# Altium schematic sheet Connections.SchDoc
size A4
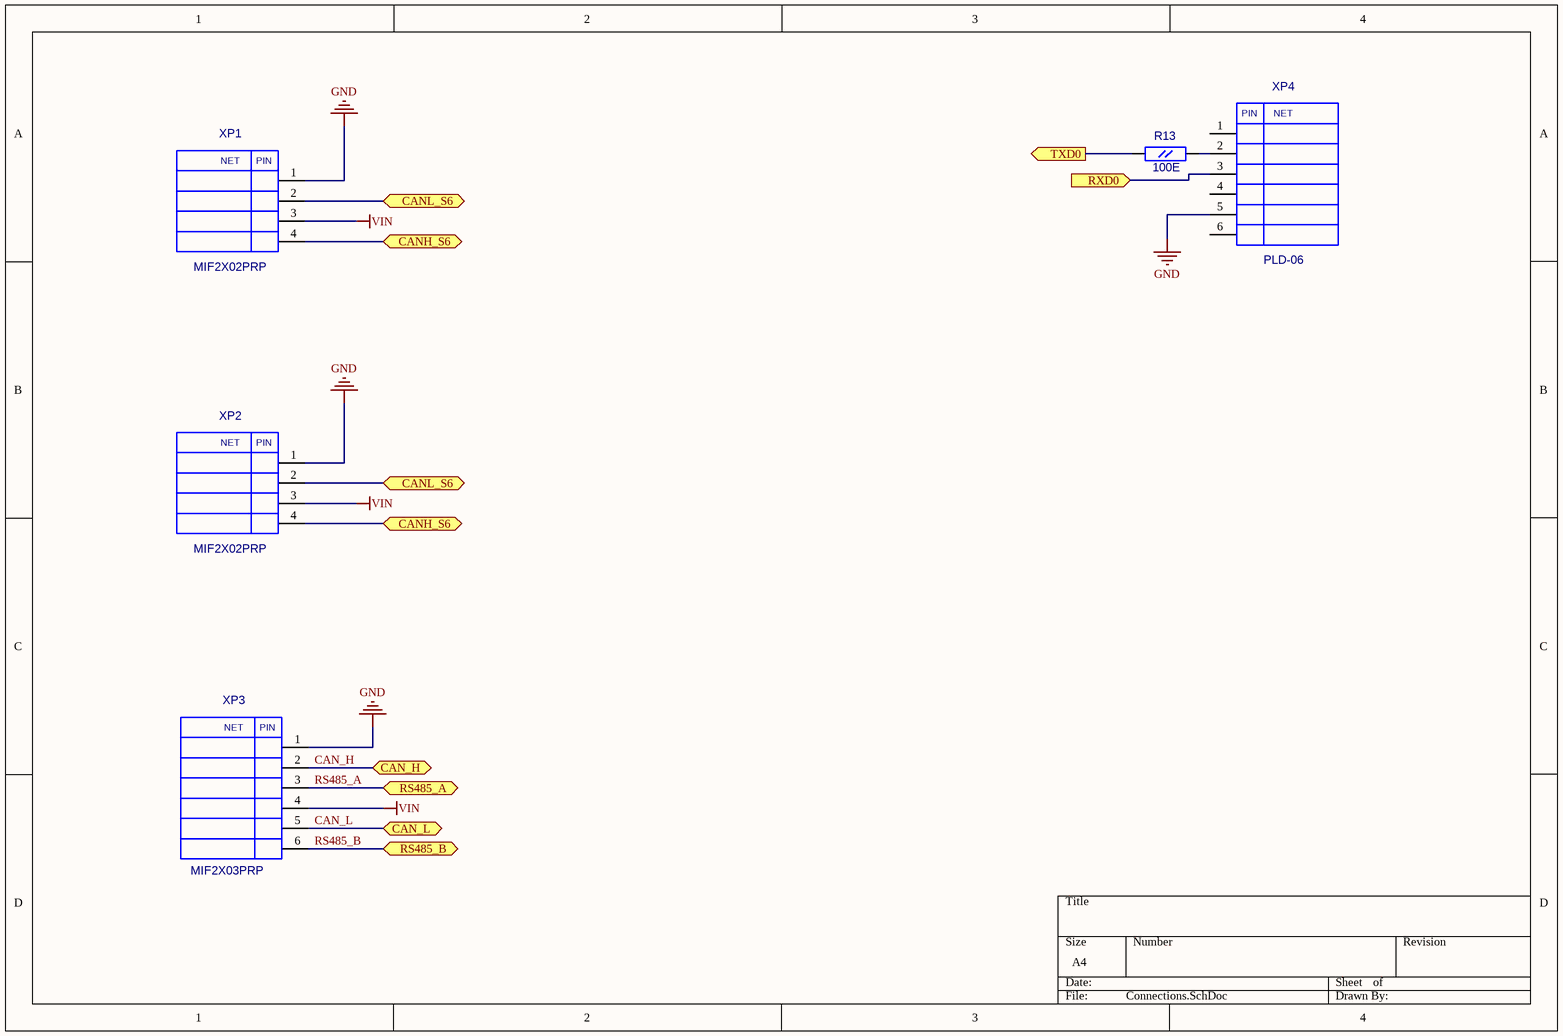
[diagram p0: Connections.SchDoc]

## Parts
R13  100E  [RC0603]
XP1  MIF2X02PRP  [MIF2X02PRP]
XP2  MIF2X02PRP  [MIF2X02PRP]
XP3  MIF2X03PRP  [MIF2X03PRP]
XP4  PLD-06  [PIN6]

## Ports
CAN_H, CAN_L, CANH_S6 (bidir), CANL_S6 (bidir), RS485_A, RS485_B, RXD0 (in), TXD0 (out)

## Nets
GND: XP1.1 XP2.1 XP3.1 XP4.5
VIN: XP1.3 XP2.3 XP3.4
CAN_H: XP3.2 ; port CAN_H
CAN_L: XP3.5 ; port CAN_L
CANH_S6: XP1.4 XP2.4 ; port CANH_S6
CANL_S6: XP1.2 XP2.2 ; port CANL_S6
RS485_A: XP3.3 ; port RS485_A
RS485_B: XP3.6 ; port RS485_B
RXD0: XP4.3 ; port RXD0
TXD0: R13.1(A) ; port TXD0
NetR13_2: R13.2(B) XP4.2

Not connected (* = marked no-connect by the designer): XP4 1 4 6

## Notes on the sheet
- (in symbol MIF2X02PRP) NET; PIN
- (in symbol MIF2X03PRP) NET; PIN
- (in symbol PLD-06) PIN; NET

## Library data of the parts
R13 = RC0603: Value: 100E
XP4 = PLD-06: PLD06; Value: *
XP1 XP2 = MIF2X02PRP: Value: *
XP3 = MIF2X03PRP: Value: *